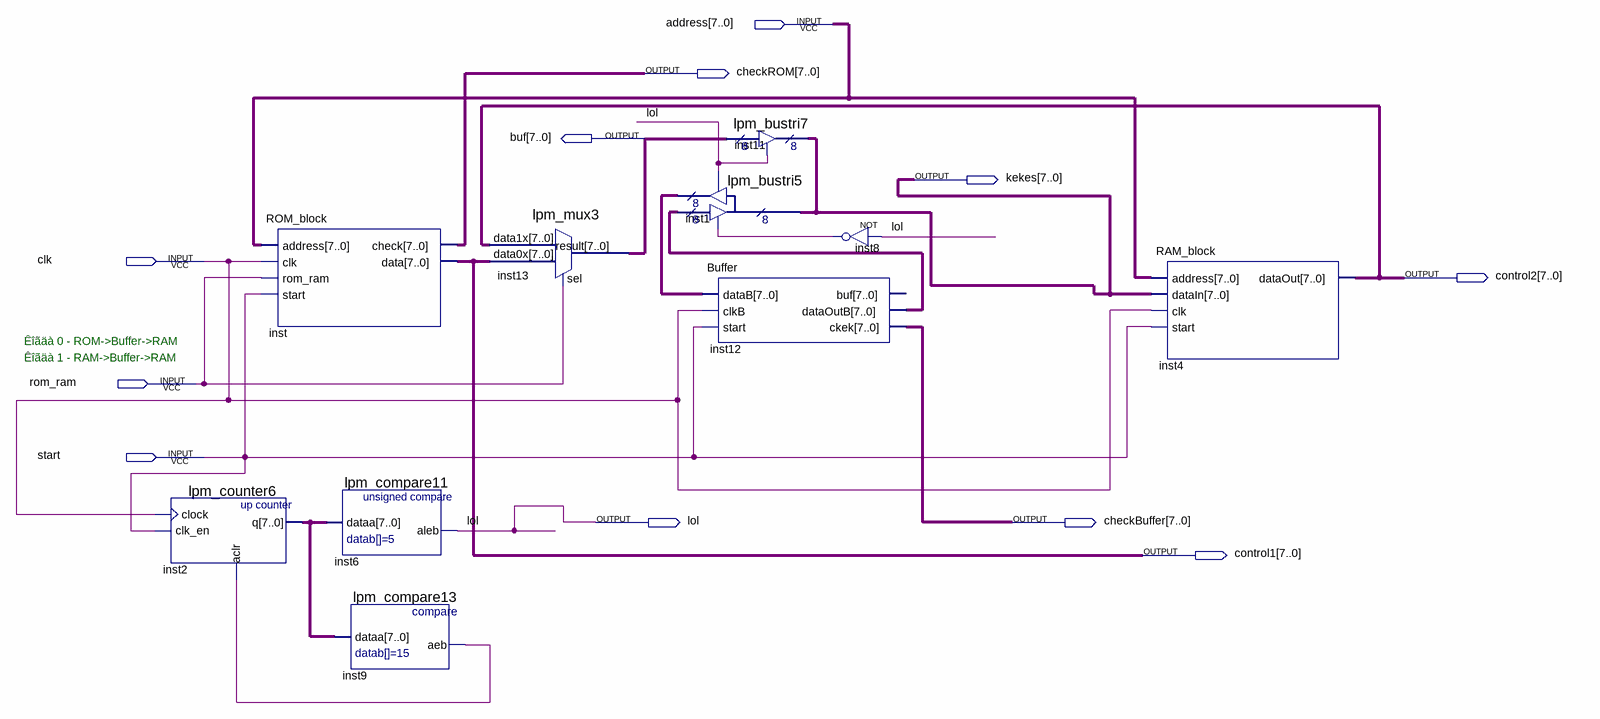
[diagram p0: schematic sheet]
// Quartus schematic laba3.bdf as structural Verilog: 10 symbols, 11 pins
module laba3 (
  input  [7:0] address,
  input  clk,
  input  rom_ram,
  input  start,
  output [7:0] checkROM,
  output [7:0] \buf ,
  output [7:0] kekes,
  output [7:0] control2,
  output lol,
  output [7:0] checkBuffer,
  output [7:0] control1
);

  wire inst8_out, inst9_aeb;
  wire [7:0] inst1_result, inst2_q, inst12_dataoutb;

  lpm_counter6 inst2 (.clock(clk), .clk_en(start), .aclr(inst9_aeb), .q(inst2_q));
  ROM_block inst (.address(address), .clk(clk), .rom_ram(rom_ram), .start(start), .check(checkROM), .data(control1));
  lpm_compare11 inst6 (.dataa(inst2_q), .aleb(lol));
  lpm_compare13 inst9 (.dataa(inst2_q), .aeb(inst9_aeb));
  lpm_mux3 inst13 (.data1x(control2), .data0x(control1), .sel(rom_ram), .result(\buf ));
  lpm_bustri5 inst1 (
    .enabledt(inst8_out), .data(inst12_dataoutb), .enabletr(lol), .result(inst1_result), .tridata(kekes));
  lpm_bustri7 inst11 (.enabledt(lol), .data(\buf ), .tridata(kekes));
  Buffer inst12 (
    .dataB(inst1_result), .clkB(clk), .start(start), .dataOutB(inst12_dataoutb), .ckek(checkBuffer));  // open: buf
  not inst8 (inst8_out, lol);
  RAM_block inst4 (.address(address), .dataIn(kekes), .clk(clk), .start(start), .dataOut(control2));

  // Notes on the sheet:
  //   Êîãäà 0 - ROM->Buffer->RAM
  //   Êîãäà 1 - RAM->Buffer->RAM
endmodule
